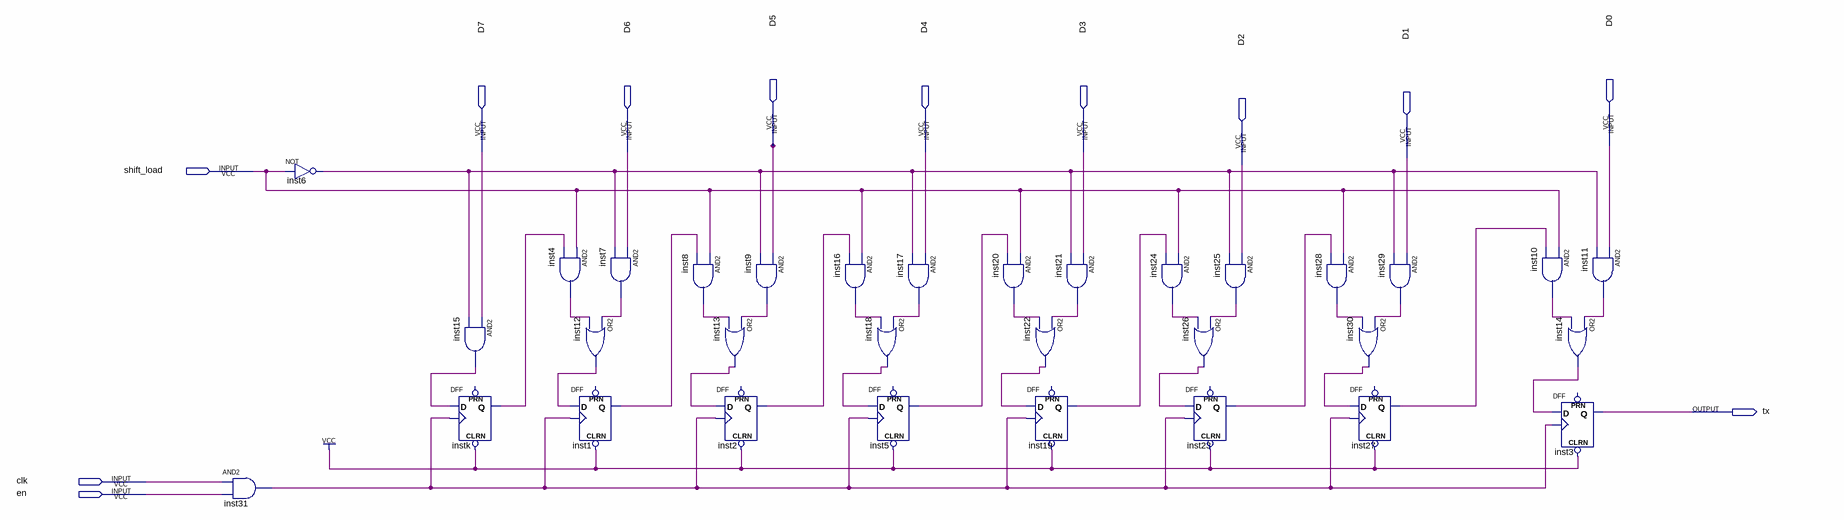
[diagram p0: schematic sheet]
// Quartus schematic uart_tx_8_bits.bdf as structural Verilog: 32 symbols, 12 pins
module uart_tx_8_bits (
  input  D5,
  input  D0,
  input  D7,
  input  D6,
  input  D4,
  input  D3,
  input  D1,
  input  D2,
  input  shift_load,
  input  clk,
  input  en,
  output tx
);

  wire inst1_q, inst2_q, inst4_out, inst5_q, inst6_out, inst7_out, inst8_out, inst9_out, inst10_out,
       inst11_out, inst12_out, inst13_out, inst14_out, inst15_out, inst16_out, inst17_out, inst18_out,
       inst19_q, inst20_out, inst21_out, inst22_out, inst23_q, inst24_out, inst25_out, inst26_out, inst27_q,
       inst28_out, inst29_out, inst30_out, inst31_out, instk_q;

  and inst31 (inst31_out, clk, en);
  not inst6 (inst6_out, shift_load);
  and inst15 (inst15_out, D7, inst6_out);
  DFF instk (.CLRN(1'b1), .CLK(inst31_out), .D(inst15_out), .Q(instk_q));  // open: PRN
  and inst4 (inst4_out, shift_load, instk_q);
  and inst7 (inst7_out, D6, inst6_out);
  or inst12 (inst12_out, inst7_out, inst4_out);
  DFF inst1 (.CLRN(1'b1), .CLK(inst31_out), .D(inst12_out), .Q(inst1_q));  // open: PRN
  and inst8 (inst8_out, shift_load, inst1_q);
  or inst13 (inst13_out, inst9_out, inst8_out);
  DFF inst2 (.CLRN(1'b1), .CLK(inst31_out), .D(inst13_out), .Q(inst2_q));  // open: PRN
  and inst9 (inst9_out, D5, inst6_out);
  and inst16 (inst16_out, shift_load, inst2_q);
  or inst18 (inst18_out, inst17_out, inst16_out);
  DFF inst5 (.CLRN(1'b1), .CLK(inst31_out), .D(inst18_out), .Q(inst5_q));  // open: PRN
  and inst17 (inst17_out, D4, inst6_out);
  and inst20 (inst20_out, shift_load, inst5_q);
  and inst21 (inst21_out, D3, inst6_out);
  or inst22 (inst22_out, inst21_out, inst20_out);
  DFF inst19 (.CLRN(1'b1), .CLK(inst31_out), .D(inst22_out), .Q(inst19_q));  // open: PRN
  and inst24 (inst24_out, shift_load, inst19_q);
  and inst25 (inst25_out, D2, inst6_out);
  or inst26 (inst26_out, inst25_out, inst24_out);
  DFF inst23 (.CLRN(1'b1), .CLK(inst31_out), .D(inst26_out), .Q(inst23_q));  // open: PRN
  and inst28 (inst28_out, shift_load, inst23_q);
  or inst30 (inst30_out, inst29_out, inst28_out);
  DFF inst27 (.CLRN(1'b1), .CLK(inst31_out), .D(inst30_out), .Q(inst27_q));  // open: PRN
  and inst29 (inst29_out, D1, inst6_out);
  and inst10 (inst10_out, shift_load, inst27_q);
  or inst14 (inst14_out, inst11_out, inst10_out);
  DFF inst3 (.CLRN(1'b1), .CLK(inst31_out), .D(inst14_out), .Q(tx));  // open: PRN
  and inst11 (inst11_out, D0, inst6_out);
endmodule
